# EAGLE design LED-OtherCat (EAGLE 6.6.0)
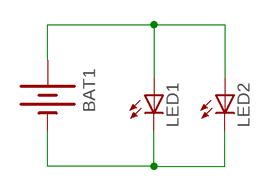
[diagram p0: schematic, sheet 1]

## Parts
BAT1  BATTERY20PTH  [BATTCOM_20MM_PTH]
LED1  LEDP-LCC-2-BACK  [P-LCC-2-TOPLED-RG]
LED2  LEDP-LCC-2-BACK  [P-LCC-2-TOPLED-RG]

## Nets
N$2: BAT1.2(-) LED1.C LED2.C
N$3: BAT1.1(+) LED1.A LED2.A

## Library data of the parts
BAT1 = SparkFun-Electromechanical:BATTERY: Battery Holders Various common sizes : AA, AAA, 18650 (PRT-12895), 20mm coin cell and 12mm coin cell. 20MM_4LEGS, BATT-10373
LED1 LED2 = adafruit:LED: LED OSRAM: - CHIPLED LG R971, LG N971, LY N971, LG Q971, LY Q971, LO R971, LY R971 LH N974, LH R974 LS Q976, LO Q976, LY Q976 LO Q996 - Hyper CHIPLED LW Q18S LB Q993, LB Q99A, LB R99A - SideLED LS A670, LO A670, LY A670, LG A670, LP A670 LB A673, LV A673, LT A673, LW A673 LH A674 LY A675 LS A676, LA A676, LO A676, LY A676, LW A676 LS A679, LY A679, LG A679 - Hyper Micro SIDELED® LS Y876, LA Y876, LO Y876, LY Y876 LT Y87S - SmartLED LW L88C, LW L88S LB L89C, LB L89S, LG L890 LS L89K, LO L89K, LY L89K LS L896, LA L896, LO L896, LY L896 - TOPLED LS T670, LO T670, LY T670, LG T670, LP T670 LSG T670, LSP T670, LSY T670, LOP T670, LYG T670 LG T671, LOG T671, LSG T671 LB T673, LV T673, LT T673, LW T673 LH T674 LS T676, LA T676, LO T676, LY T676, LB T676, LH T676, LSB T676, LW T676 LB T67C, LV T67C, LT T67C, LS T67K, LO T67K, LY T67K, LW E67C LS E67B, LA E67B, LO E67B, LY E67B, LB E67C, LV E67C, LT E67C LW T67C LS T679, LY T679, LG T679 LS T770, LO T770, LY T770, LG T770, LP T770 LB T773, LV T773, LT T773, LW T773 LH T774 LS E675, LA E675, LY E675, LS T675 LS T776, LA T776, LO T776, LY T776, LB T776 LHGB T686 LT T68C, LB T68C - Hyper Mini TOPLED® LB M676 - Mini TOPLED Santana® LG M470 LS M47K, LO M47K, LY M47K Source: http://www.osram.convergy.de/

## Board
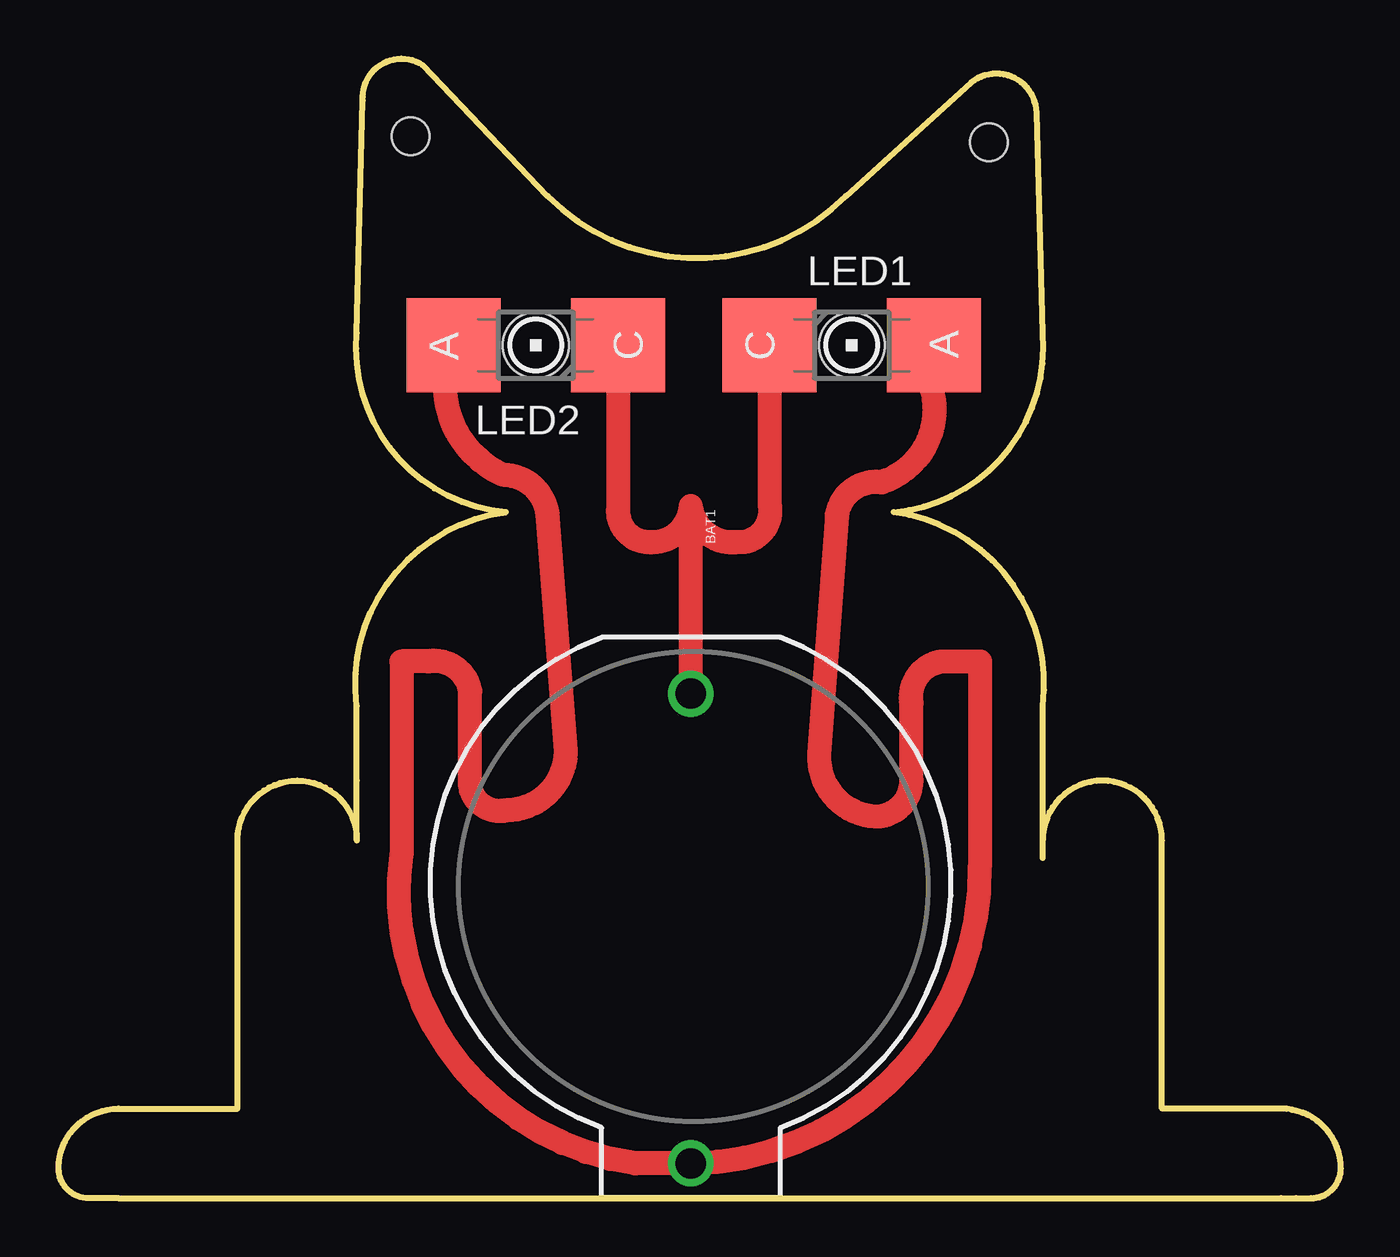
[diagram p1: board, top side]

Size 54.61 x 48.52 mm. Coordinates in mm from the lower left corner, seen from the top.
Outline: 2.54,0 52.07,0
Outline: 52.07,0 52.7,0
Outline: 52.07,0 53.34,0 arc90 54.61,1.27 arc90 52.07,3.81 46.99,3.81 46.99,15.24 arc180 41.91,15.24
Outline: 41.91,14.48 41.91,15.75 41.91,20.95 arc90 35.56,29.21 arc90 41.91,36.83 41.66,46.23 arc127 38.86,47.5 33.53,42.67 arc-90 20.83,42.67 15.49,48.26 arc127 12.95,46.74 12.7,36.83 arc90 19.05,29.21 arc90 12.7,20.95 12.7,17.78 12.7,15.24 arc180 7.62,15.24 7.62,3.81 2.54,3.81 arc90 0,1.27 arc90 1.27,0 2.54,0
Outline: 2.54,0 1.91,0
Copper layers (1*16): Top 0.035mm / dielectric 1.5mm / Bottom 0.035mm
Design rules "Othermill-DRC-1-32": minimum track width 8mil, minimum drill 0.8mm, track to track 0.794003125mm, track to pad 0.794003125mm, pad to pad 0.794003125mm, via to via 0.794003125mm, smd to smd 0mil, copper to edge 0mil, drill to drill 1mil, minimum pad ring 10mil, minimum via ring 10mil, stop-mask expansion 1mil, vias tented up to drill 30mil, thermal gap 10mil
Holes 1.6 mm at 14.99,45.21 39.62,44.96

### Footprints (pad centres in the part's own frame; a part is rotated, then mirrored left to right if it is on the bottom)
BATTCOM_20MM_PTH = drill 1.3: 1 11.85,0; 2 -8.15,0
P-LCC-2-TOPLED-RG = smd 4 x 4: A 0,3.5; C 0,-3.5 | hole 2.8: 0,0

### Placement (x,y rotation side)
BAT1  26.92,13.34 270 top
LED1  33.78,36.32 270 top
LED2  20.32,36.32 90 top

### Tracks (layer width: path | path; a pad name or v marks a point on that pad's centre or on a via)
N$2
  Top 1.016: BAT1.2 26.92,29.46 | LED1.C 30.28,29.52 arc-90 29.21,27.94 28.96,27.94 arc-90 26.92,29.46 | LED2.C 23.82,29.27 arc90 25.15,27.94 arc90 26.92,29.46
N$3
  Top 1.016: LED2.A arc90 18.92,30.8 arc-90 20.83,28.9 21.59,19.05 arc-90 19.05,16.51 arc-90 17.53,17.53 17.53,21.59 arc90 15.75,22.86 14.61,22.86 14.61,14.61 arc90 24.55,1.49 BAT1.1 arc90 39.24,14.19 39.24,22.86 37.59,22.86 arc90 36.32,21.08 36.32,17.78 arc-90 34.8,16.26 arc-90 32.38,18.92 33.15,29.08 arc-90 35.05,30.48 arc90 37.14,34.6 37.14,35.25 LED1.A